# Altium schematic sheet IP5209_Charge1s_Out2s.SchDoc
size A3
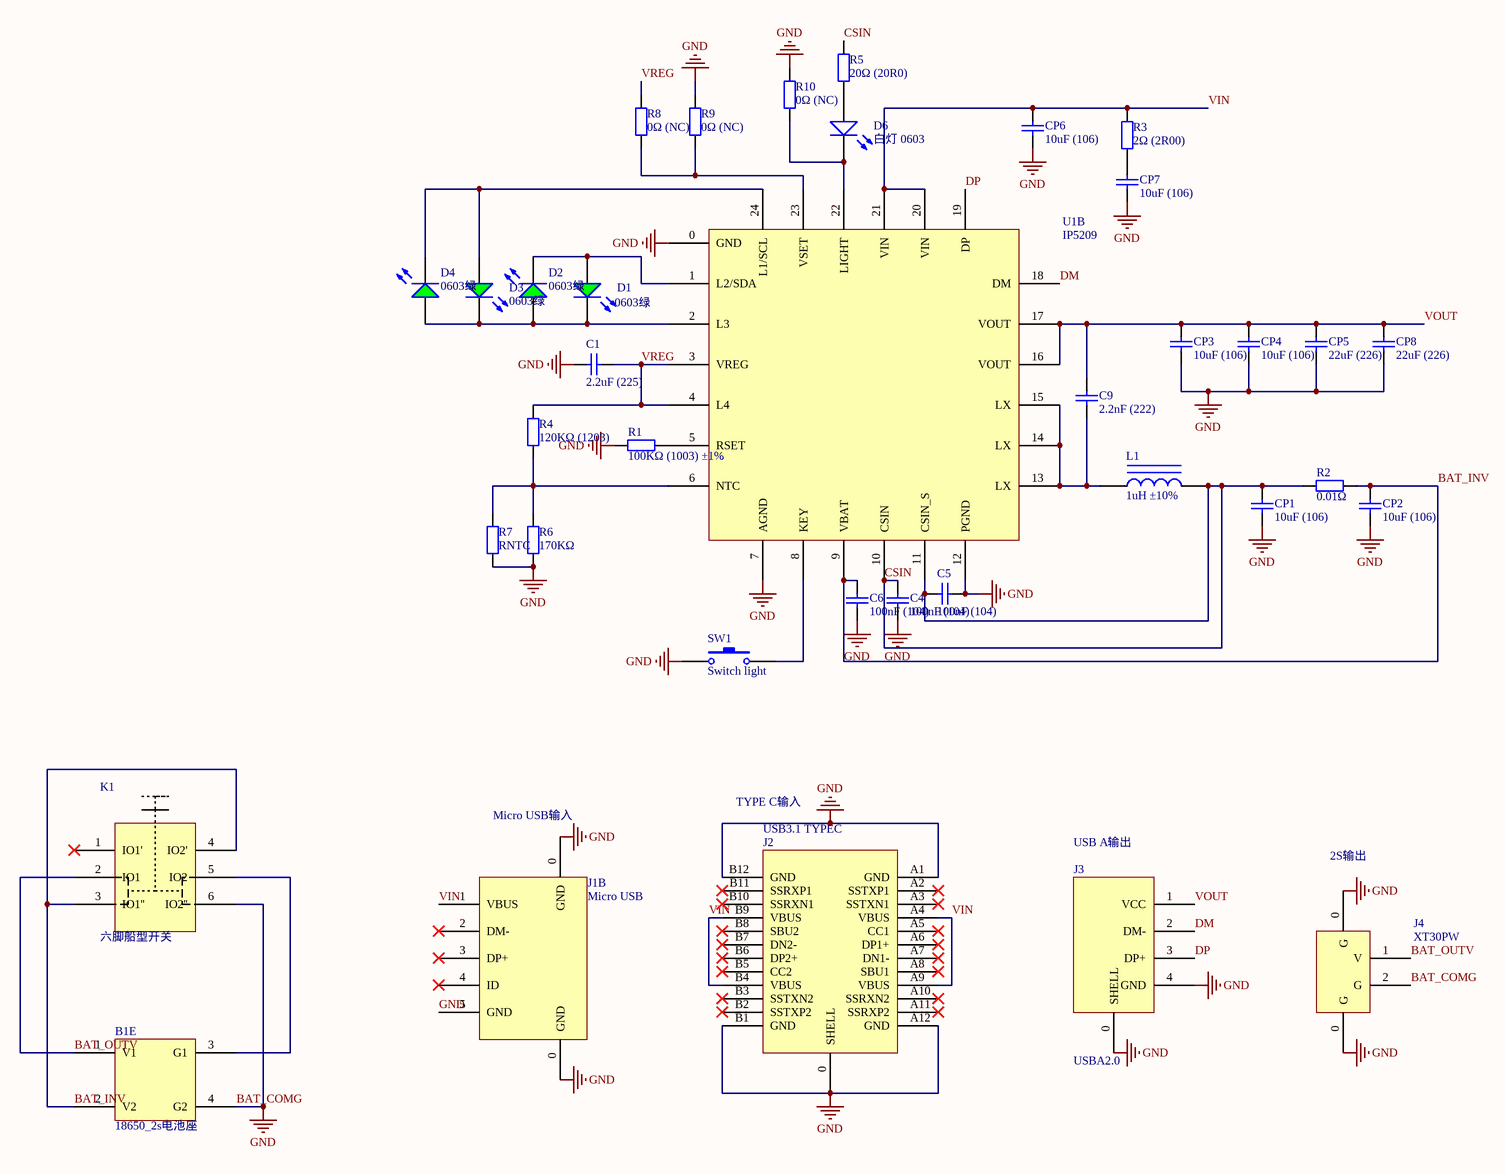
[diagram p0: IP5209_Charge1s_Out2s.SchDoc]

## Parts
B1  18650_2s电池座  [186502s电池座]  (part E of 5)
C1  2.2uF (225)  [0603_C]
C4  100nF (104)  [0603_C]
C5  100nF (104)  [0603_C]
C6  100nF (104)  [0603_C]
C9  2.2nF (222)  [0603_C]
CP1  10uF (106)  [0603_C]
CP2  10uF (106)  [0603_C]
CP3  10uF (106)  [0603_C]
CP4  10uF (106)  [0603_C]
CP5  22uF (226)  [0603_C]
CP6  10uF (106)  [0603_C]
CP7  10uF (106)  [0603_C]
CP8  22uF (226)  [0603_C]
D1  0603绿  [0603_LED_S1]
D2  0603绿  [0603_LED_S1]
D3  0603绿  [0603_LED_S1]
D4  0603绿  [0603_LED_S1]
D6  白灯 0603  [0603_LED_S1]
J1  Micro USB  [MicroUSB-贴片]  (part B of 2)
J2  USB3.1 TYPEC  [USB3.1 TYPE-C 26P 母座]
J3  USBA2.0  [USB2.0 A母全贴无边]
J4  XT30PW  [XT30PW-F]
K1  六脚船型开关  [六脚船型开关21*15]
L1  1uH ±10%  [22UH L]
R1  100KΩ (1003) ±1%  [0603_R]
R2  0.01Ω  [1206_R]
R3  2Ω (2R00)  [0603_R]
R4  120KΩ (1203)  [0603_R]
R5  20Ω (20R0)  [0603_R]
R6  170KΩ  [0603_R]
R7  RNTC  [0603_R]
R8  0Ω (NC)  [0603_R]
R9  0Ω (NC)  [0603_R]
R10  0Ω (NC)  [0603_R]
SW1  Switch light  [KEY]
U1  IP5209  [IP5209]  (part B of 2)

## Nets
BAT_COMG: B1.4(G2) C1.1 C4.1 C5.2 C6.1 CP1.1 CP2.1 CP3.1 CP4.1 CP5.2 CP6.1 CP7.1 CP8.2 J1.0(GND) J1.5(GND) J2.0(SHELL) J2.A1(GND) J2.A12(GND) J2.B1(GND) J2.B12(GND) J3.0(SHELL) J3.4(GND) J4.0(G) J4.2(G) K1.6(IO2'') R1.1 R6.1 R7.1 R9.2 R10.2 SW1.1 U1.0(GND) U1.7(AGND) U1.12(PGND)  [also labelled GND]
BAT_INV: B1.2(V2) C6.2 CP2.2 K1.3(IO1'') K1.4(IO2') R2.2 U1.9(VBAT)
BAT_OUTV: B1.1(V1) J4.1(V) K1.2(IO1)
CSIN: C4.2 C5.1 CP1.2 L1.2 R2.1 R5.2 U1.10(CSIN) U1.11(CSIN_S)
DM: J3.2(DM-) U1.18(DM)
DP: J3.3(DP+) U1.19(DP)
VIN: CP6.2 J1.1(VBUS) J2.A4(VBUS) J2.A9(VBUS) J2.B4(VBUS) J2.B9(VBUS) R3.2 U1.20(VIN) U1.21(VIN)
VOUT: C9.2 CP3.2 CP4.2 CP5.1 CP8.1 J3.1(VCC) U1.16(VOUT) U1.17(VOUT)
VREG: C1.2 R4.2 R8.2 U1.3(VREG) U1.4(L4)
NetB1_3: B1.3(G1) K1.5(IO2)
NetC9_1: C9.1 L1.1 U1.13(LX) U1.14(LX) U1.15(LX)
NetCP7_2: CP7.2 R3.1
NetD1_A: D1.A D2.K U1.1(L2/SDA)
NetD1_K: D1.K D2.A D3.K D4.A U1.2(L3)
NetD3_A: D3.A D4.K U1.24(L1/SCL)
NetD6_A: D6.A R5.1
NetD6_K: D6.K R10.1 U1.22(LIGHT)
NetR1_2: R1.2 U1.5(RSET)
NetR4_1: R4.1 R6.2 R7.2 U1.6(NTC)
NetR8_1: R8.1 R9.1 U1.23(VSET)
NetSW1_2: SW1.2 U1.8(KEY)

Not connected (* = marked no-connect by the designer): J1 2(DM-)* 3(DP+)* 4(ID)*; J2 A2(SSTXP1)* A3(SSTXN1)* A5(CC1)* A6(DP1+)* A7(DN1-)* A8(SBU1)* A10(SSRXN2)* A11(SSRXP2)* B2(SSTXP2)* B3(SSTXN2)* B5(CC2)* B6(DP2+)* B7(DN2-)* B8(SBU2)* B10(SSRXN1)* B11(SSRXP1)*; K1 1(IO1')*

## Notes on the sheet
- TYPE C输入
- Micro USB输入
- USB A输出
- 2S输出

## Library data of the parts
C1 = 0603 2.2uF (225) 10% 16V: 贴片电容; ComponentLink1Description: 供应商链接; ComponentLink1URL: http://www.szlcsc.com/product/details_24366.html; Package: 0603; Supplier: LC; SuppliersPartNumber: C23630
C4-C6 = 0603 100nF (104) 10% 50V: 贴片电容; ComponentLink1Description: 供应商链接; ComponentLink1URL: http://www.szlcsc.com/product/details_15331.html; Package: 0603; Supplier: LC; SuppliersPartNumber: C14663
C9 = 0603 2.2nF (222) 10% 50V: 贴片电容; ComponentLink1Description: 供应商链接; ComponentLink1URL: http://www.szlcsc.com/product/details_1956.html; Package: 0603; Supplier: LC; SuppliersPartNumber: C1604
CP1-CP4 CP6 CP7 = 0603 10uF (106) 10% 10V: 贴片电容; ComponentLink1Description: 供应商链接; ComponentLink1URL: http://www.szlcsc.com/product/details_20411.html; Package: 0603; Supplier: LC; SuppliersPartNumber: C19702
CP5 CP8 = 0603 22uF (226) 20% 6.3V: 贴片电容; ComponentLink1Description: 供应商链接; ComponentLink1URL: http://www.szlcsc.com/product/details_60514.html; Package: 0603; Supplier: LC; SuppliersPartNumber: C59461
D1-D4 = 0603 绿灯: 发光二极管; ComponentLink1Description: 供应商链接; ComponentLink1URL: http://www.szlcsc.com/product/details_73152.html; Package: 0603; Supplier: LC; SuppliersPartNumber: C72043
D6 = 0603 白灯: 发光二极管; ComponentLink1Description: 供应商链接; ComponentLink1URL: http://www.szlcsc.com/product/details_2663.html; Package: 0603; Supplier: LC; SuppliersPartNumber: C2290
J2 = USB3.1 TYPEC: USB 3.1 TYPE-C 26P 母座 90度 带卡扣 焊板式 4固定脚 无边双向; ComponentLink1Description: 淘宝链接; ComponentLink1URL: https://item.taobao.com/item.htm?spm=a1z09.2.0.0.218a2e8d061sbX&id=537324480875&_u=729bem1b42b5
J3 = USBA2.0: USB2.0 A母全贴无边-AF 13.9 MM 2固定贴片 卷边; ComponentLink1Description: 淘宝链接; ComponentLink1URL: https://item.taobao.com/item.htm?spm=a1z09.2.0.0.218a2e8d061sbX&id=529396688207&_u=729bem1b349e
L1 = 0805 1uH 10%: 贴片电感; ComponentLink1Description: 供应商链接; ComponentLink1URL: http://www.szlcsc.com/product/details_1394.html; Package: 0805; Supplier: LC; SuppliersPartNumber: C1042
R1 = 0603 100KΩ (1003) 1%: 贴片电阻; ComponentLink1Description: 供应商链接; ComponentLink1URL: http://www.szlcsc.com/product/details_26546.html; Package: 0603; Supplier: LC; SuppliersPartNumber: C25803
R2 = 1206 0.1Ω (R100) 1%: 贴片电阻; ComponentLink1Description: 供应商链接; ComponentLink1URL: http://www.szlcsc.com/product/details_26077.html; Package: 1206; Supplier: LC; SuppliersPartNumber: C25334
R3 = 0603 2Ω (2R00) 1%: 贴片电阻; ComponentLink1Description: 供应商链接; ComponentLink1URL: http://www.szlcsc.com/product/details_23704.html; Package: 0603; Supplier: LC; SuppliersPartNumber: C22977
R4 R6 = 0603 120KΩ (1203) 1%: 贴片电阻; ComponentLink1Description: 供应商链接; ComponentLink1URL: http://www.szlcsc.com/product/details_26551.html; Package: 0603; Supplier: LC; SuppliersPartNumber: C25808
R5 = 0603 20Ω (20R0) 1%: 贴片电阻; ComponentLink1Description: 供应商链接; ComponentLink1URL: http://www.szlcsc.com/product/details_23677.html; Package: 0603; Supplier: LC; SuppliersPartNumber: C22950
R7-R10 = 0603 0Ω (0R0) 1%: 贴片电阻; ComponentLink1Description: 供应商链接; ComponentLink1URL: http://www.szlcsc.com/product/details_21903.html; Package: 0603; Supplier: LC; SuppliersPartNumber: C21189
SW1 = SW-PB: Switch; Published: 24-Mar-1999; LatestRevisionDate: 17-Jul-2002; LatestRevisionNote: Re-released for DXP Platform.; PackageReference: SPST-2; Publisher: Altium Limited; PackageDescription: Switch; 2 Leads